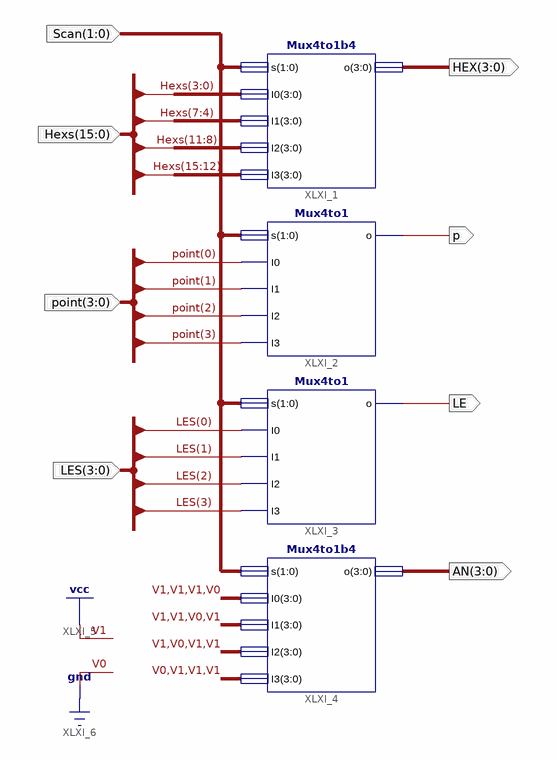
[diagram p0: schematic sheet 1]
// Xilinx ISE schematic DisplaySync.sch (kintex7) as structural Verilog: 4 symbols, 8 ports
module DisplaySync (
  input  [15:0] Hexs,
  input  [1:0] Scan,
  input  [3:0] point,
  input  [3:0] LES,
  output [3:0] HEX,
  output p,
  output LE,
  output [3:0] AN
);

  Mux4to1b4 XLXI_1 (.I0(Hexs[3:0]), .I1(Hexs[7:4]), .I2(Hexs[11:8]), .I3(Hexs[15:12]), .o(HEX), .s(Scan));
  Mux4to1 XLXI_2 (.I0(point[0]), .I1(point[1]), .I2(point[2]), .I3(point[3]), .o(p), .s(Scan));
  Mux4to1 XLXI_3 (.I0(LES[0]), .I1(LES[1]), .I2(LES[2]), .I3(LES[3]), .o(LE), .s(Scan));
  Mux4to1b4 XLXI_4 (.I0(4'b1110), .I1(4'b1101), .I2(4'b1011), .I3(4'b0111), .o(AN), .s(Scan));
endmodule
